# Altium schematic sheet 04 - USB_Flash.SchDoc
size A4; DocumentNumber: 1; SheetNumber: 1; SheetTotal: 3; SchemaTitle: USB Flash
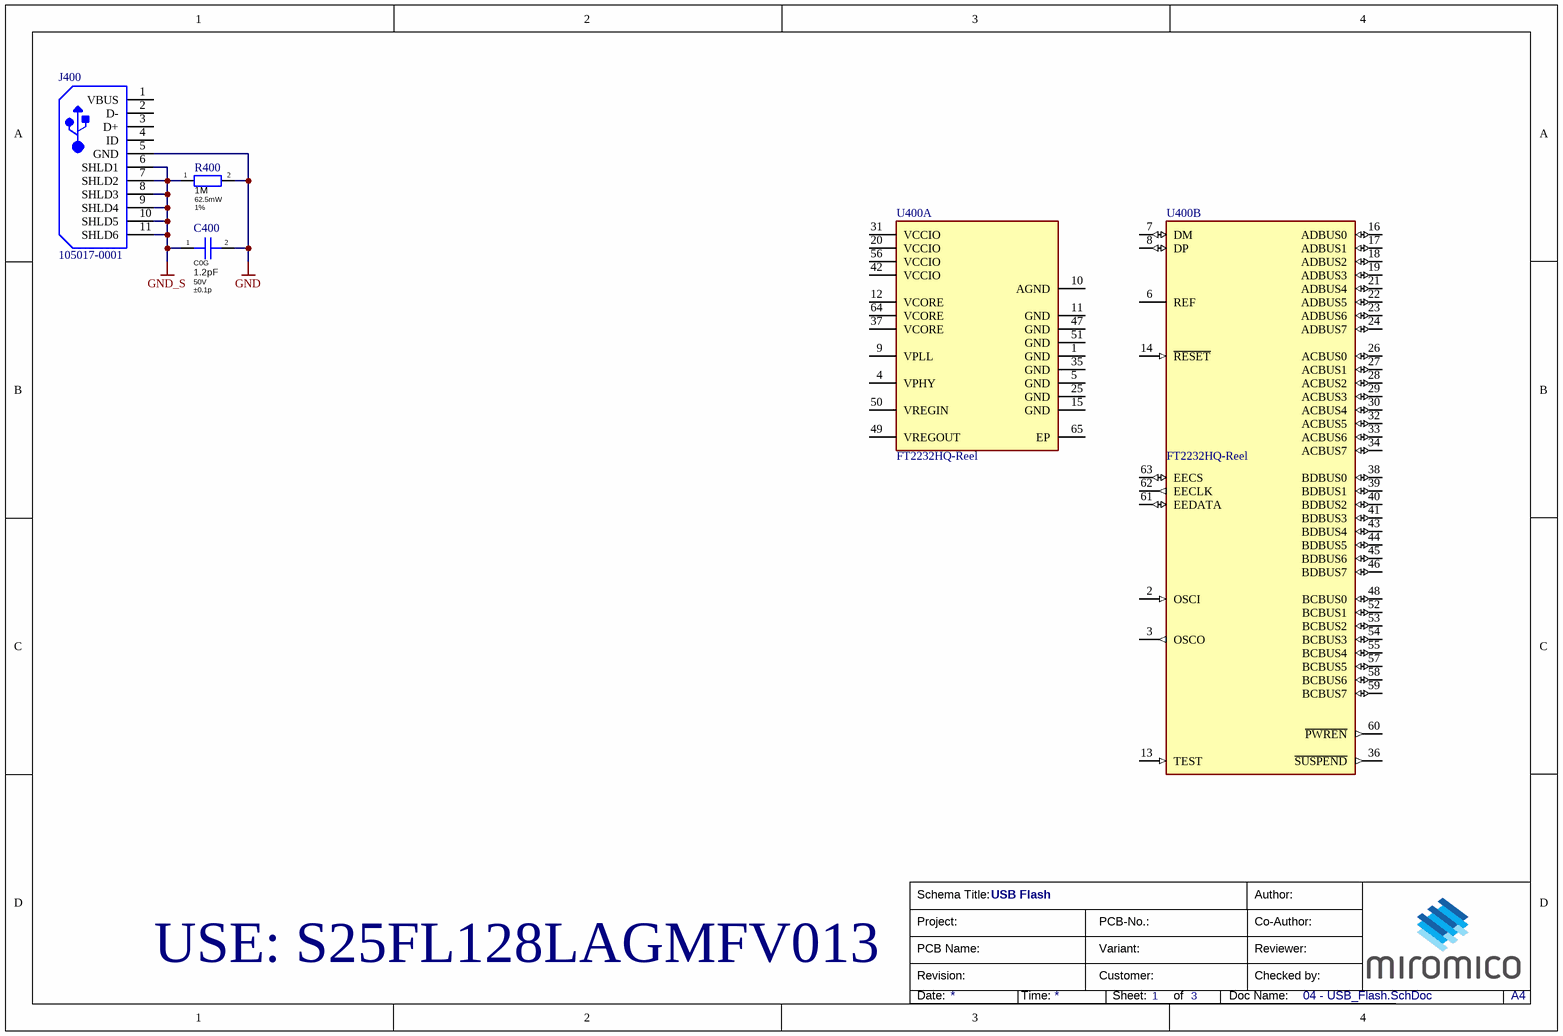
[diagram p0: 04 - USB_Flash.SchDoc]

## Parts
C400  Dielectric: C0G  Capacitance: 1.2pF  Voltage Rating: 50V  Tolerance: ±0.1p  [CAPC0402(1005)60_L]  (hidden comment: 500R07S1R2BV4T)
J400  105017-0001  [105017-0001-Footprint-1]
R400  Resistance: 1M  Power Rating: 62.5mW  Tolerance: 1%  [RESC0402(1005)_L]  (hidden comment: RMCF0402FT1M00)
U400  FT2232HQ-Reel  [FP-FT2232HQ-Reel-MFG]  (parts A,B of 2)

## Nets
GND: C400.2 J400.5(GND) R400.2
GND_S: C400.1 J400.6(SHLD1) J400.7(SHLD2) J400.8(SHLD3) J400.9(SHLD4) J400.10(SHLD5) J400.11(SHLD6) R400.1

Not connected (* = marked no-connect by the designer): J400 1(VBUS) 2(D-) 3(D+) 4(ID); U400 1(GND) 2(OSCI) 3(OSCO) 4(VPHY) 5(GND) 6(REF) 7(DM) 8(DP) 9(VPLL) 10(AGND) 11(GND) 12(VCORE) 13(TEST) 14(~{RESET}) 15(GND) 16(ADBUS0) 17(ADBUS1) 18(ADBUS2) 19(ADBUS3) 20(VCCIO) 21(ADBUS4) 22(ADBUS5) 23(ADBUS6) 24(ADBUS7) 25(GND) 26(ACBUS0) 27(ACBUS1) 28(ACBUS2) 29(ACBUS3) 30(ACBUS4) 31(VCCIO) 32(ACBUS5) 33(ACBUS6) 34(ACBUS7) 35(GND) 36(~{SUSPEND}) 37(VCORE) 38(BDBUS0) 39(BDBUS1) 40(BDBUS2) 41(BDBUS3) 42(VCCIO) 43(BDBUS4) 44(BDBUS5) 45(BDBUS6) 46(BDBUS7) 47(GND) 48(BCBUS0) 49(VREGOUT) 50(VREGIN) 51(GND) 52(BCBUS1) 53(BCBUS2) 54(BCBUS3) 55(BCBUS4) 56(VCCIO) 57(BCBUS5) 58(BCBUS6) 59(BCBUS7) 60(~{PWREN}) 61(EEDATA) 62(EECLK) 63(EECS) 64(VCORE) 65(EP)

## Notes on the sheet
- USE: S25FL128LAGMFV013
- Schema Title:
- Project:
- PCB-No.:
- Author:
- Co-Author:
- Revision:
- PCB Name:
- Customer:
- Variant:
- Reviewer:
- Checked by:
- Date:
- Time:
- Sheet:
- of
- Doc Name:
- A4

## Library data of the parts
C400 = CMP-00585-01: 1.2pF ±0.1pF 50V Ceramic Capacitor C0G, NP0 0402 (1005 Metric); Manufacturer: Johanson Technology Inc.; Case Code (Imperial): 0402; Radiation Hardening: No; Height: 0.64mm; Min Operating Temperature: -55°C; Supplier 1: Digi-Key; Packaging: Tape and Reel; Series: S; Package Quantity: 10000; Dielectric Material: Ceramic; Manufacturer Part Number: 500R07S1R2BV4T; Voltage Rating (DC): 50V; Case/Package: 0402; Contact Plating: Tin,Matte; Depth: 0.51mm; Width: 0.02inch; Termination: SMD/SMT; Supplier Part Number 1: 712-1268-1-ND; REACH SVHC: Unknown; Max Operating Temperature: 125°C; Case Code (Metric): 1005; ComponentLink1Description: Datasheet; Construction: Flat; Number of Pins: 2; Thickness: 0.024inch; Length: 1.02mm
J400 = CMP-00161-04: USB - micro B USB 2.0 Receptacle Connector 5 Position Surface Mount, Right Angle; Through Hole; Manufacturer: Molex, LLC; Manufacturer Part Number: 1050170001; Number of Circuits: 5; Voltage Rating: 30V; Current Rating: 1.8A; USB Standard: USB 2.0; Pitch: 0.65mm; Number of Ports: 1; Connector Type: Receptacle, USB; Depth: 7.5mm; Contact Plating: Gold; Contact Material: Copper, Copper Alloy; Features: Shielded; ComponentLink1Description: Datasheet; Orientation: Right Angle; Gender: Receptacle; Supplier 1: Digikey; Package Quantity: 1; Length: 8.2mm; Number of Contacts: 5; Packaging: Tape and Reel; Datasheet: https://www.molex.com/pdm_docs/sd/1050170001_sd.pdf; Halogen Free: Low Halogen; REACH SVHC: Unknown; Number of Terminals: 5; Radiation Hardening: No; Housing Material: Polymer; Max Voltage Rating (AC): 30V; Supplier Part Number 1: WM1399CT-ND; ComponentLink1URL: https://www.molex.com/pdm_docs/sd/1050170001_sd.pdf; Min Operating Temperature: -20°C; Number of Positions: 5; Voltage Rating (AC): 30V; Termination: Solder; Mount: Surface Mount; Max Operating Temperature: 85°C
R400 = CMP-00464-01: 1 MOhms ±1% 0,063W, 1/16W Chipwiderstand 0402 (1005 metrisch) AutomobilzulassungAEC-Q200 Dickschicht; Manufacturer: Stackpole Electronics Inc; Temperature Coefficient: 100ppm/°C; Max Power Dissipation: 63mW; ComponentLink1URL: https://www.seielect.com/catalog/sei-rmcf_rmcp.pdf; ComponentLink1Description: Datasheet; Max Operating Temperature: 155°C; Case/Package: 0402; Lead Free: Lead Free; Radiation Hardening: No; Min Operating Temperature: -55°C; Height: 0.016inch; Case Code (Imperial): 0402; Mount: Surface Mount; Number of Terminations: 2; Manufacturer Part Number: RMCF0402FT1M00; Features: Automotive AEC-Q200; Contact Plating: Tin,Matte; Supplier Part Number 1: RMCF0402FT1M00CT-ND; Width: 0.02inch; Length: 1mm; Packaging: Tape and Reel; Depth: 0.5mm; Military Standard: Not; Resistor Type: Thick Film; Supplier 1: Digi-Key; Case Code (Metric): 1005
U400 = CMP-0078-00004-5: IC USB HS DUAL UART/FIFO 64-QFN; Manufacturer: FTDI; Min Supply Voltage: 1.62V; Ciiva Ids: 1315829; Nominal Supply Current: 5-70mA; Standoff Height: 0mm; Import Ts: 1521843541; Number Of Ports: 1; Max Supply Voltage: 3.63V; Data Rate: 480Mbits/s; Interface: I2C,SPI,UART,USB,RS-232,RS-485,RS-422,Other; Usb Standard: USB 2.0; Octopart: https://octopart.com/ft2232hq-reel-ftdi-19172126; Ipc Land Pattern Name: QFN50P900X900X85-64; Ambient Temperature Range High: +85°C; RoHS: TRUE; Manufacturer Part Number: FT2232HQ-Reel; Automotive: No; Footprint Url: https://www.ftdichip.com/Support/Documents/TechnicalNotes/TN_166%20FTDI%20Example%20IC%20PCB%20Footprints.pdf; Temperature Range High: +85°C; ComponentLink2Description: Datasheet; Ambient Temperature Range Low: -40°C; Mouser Description: USB Interface IC USB HS to Dual UART/ FIFO/SPI/JTAG/I2C; ComponentLink2URL: https://www.ftdichip.com/Support/Documents/DataSheets/ICs/DS_FT2232H.pdf; Digikey Description: IC USB HS DUAL UART/FIFO 64-QFN; Release Date: 1383921489; Height: 0.9mm; Lead Free: Yes; Package: QFN64; Device Class L1: Integrated Circuits (ICs); Temperature: -40°C to +85°C; Temperature Range Low: -40°C; Category: IC; Device Class L2: Interface ICs; Device Class L3: USB Interface ICs